# EAGLE design ap3036b-boost-driver-mk-2.0 (EAGLE 7.5.0)
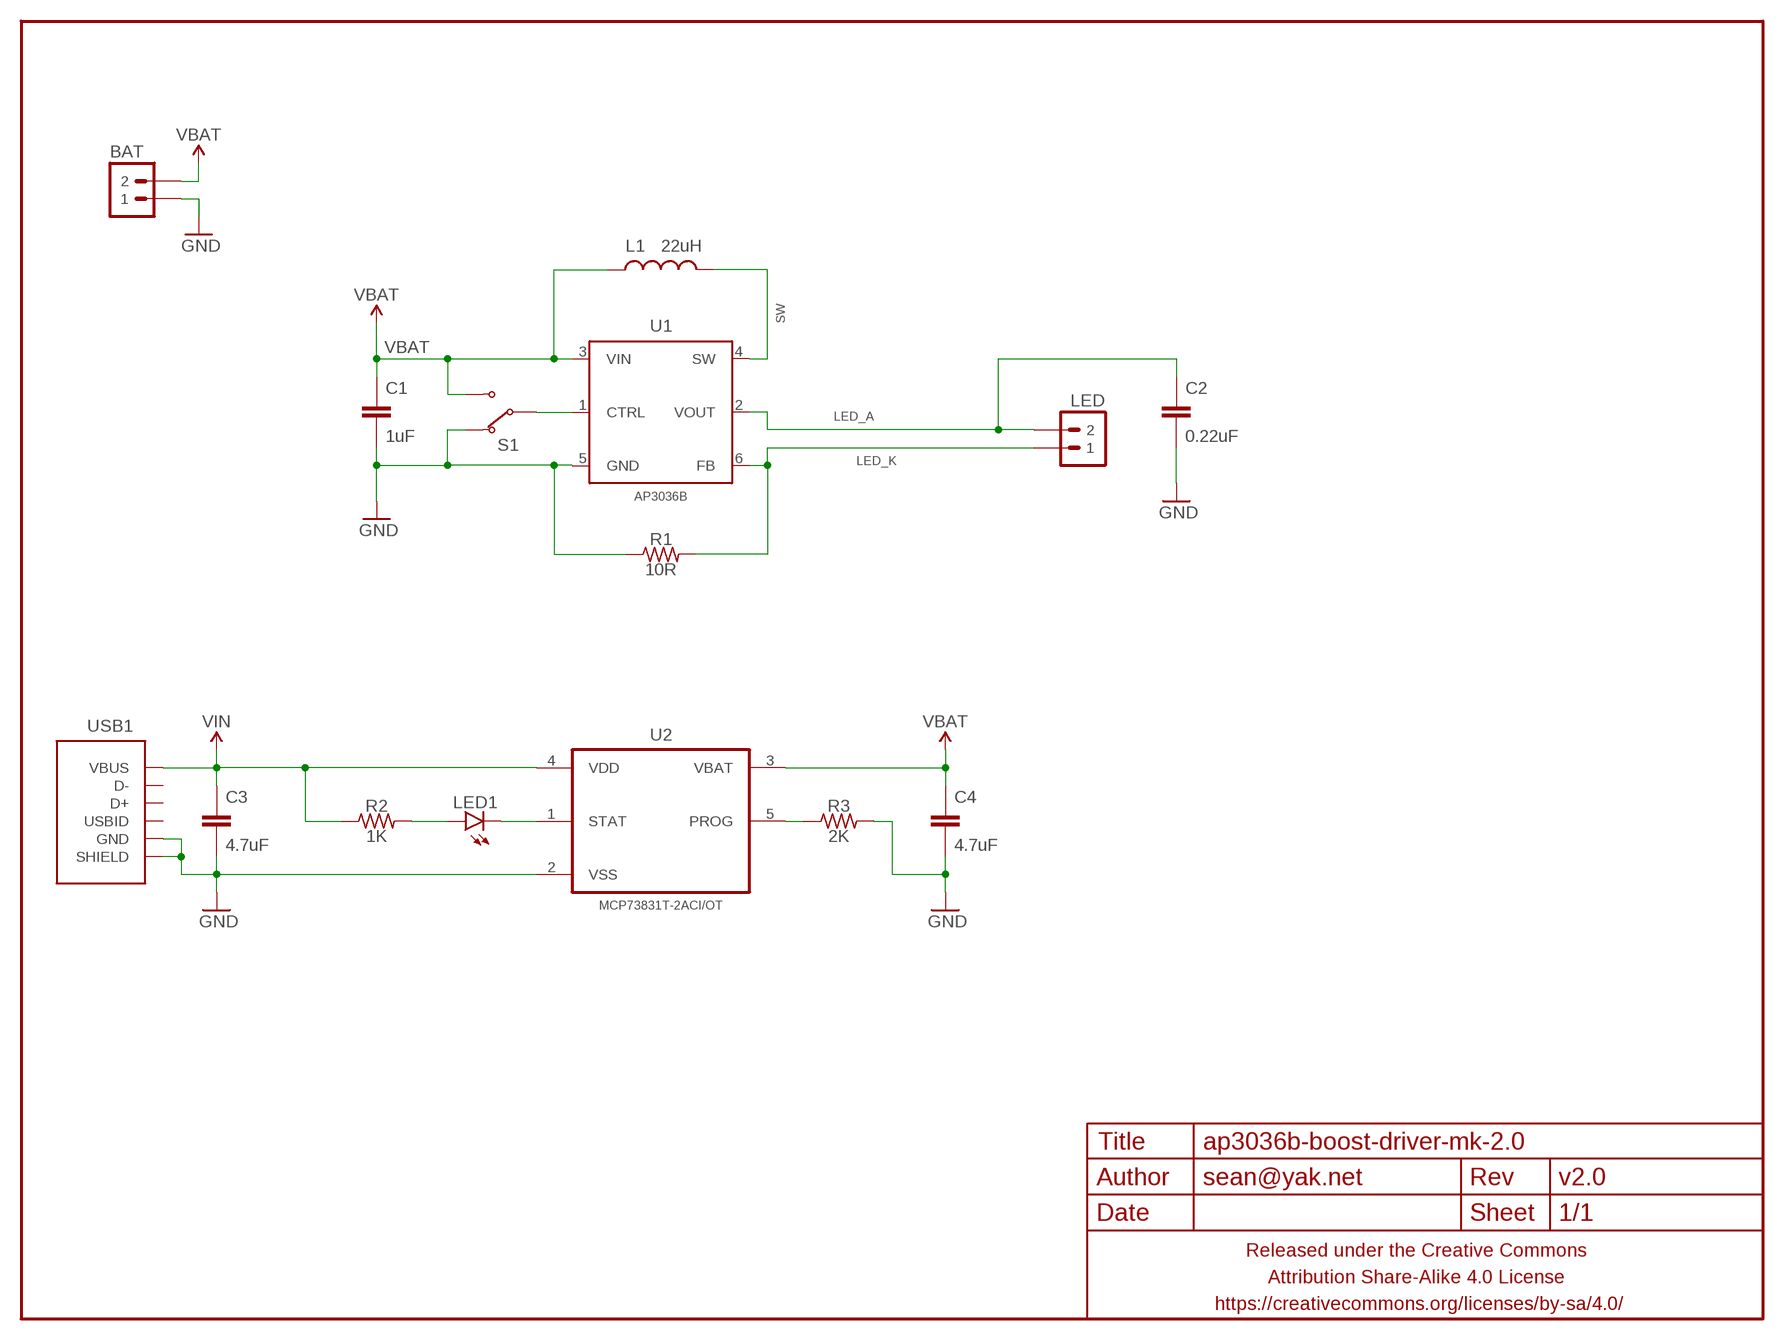
[diagram p0: schematic, sheet 1]

## Parts
BAT  M02PTH-CENTERED  [1X02-CENTER]
C1  1uF  CAPACITOR-CERAMICC0603-TIGHTER  [C0603-TIGHTER]
C2  0.22uF  CAPACITOR-CERAMICC0603-TIGHTER  [C0603-TIGHTER]
C3  4.7uF  CAPACITOR-CERAMICC0603-TIGHTER  [C0603-TIGHTER]
C4  4.7uF  CAPACITOR-CERAMICC0603-TIGHTER  [C0603-TIGHTER]
FRAME1  FRAME-LETTERNO_PACKAGE  [DUMMY]
L1  22uH  INDUCTOR0603-TIGHTER  [L0603]
LED  M02PTH-CENTERED  [1X02-CENTER]
LED1  LED0603-TIGHT  [LED-0603-TIGHT]
R1  10R  RESISTORR0603-TIGHTER  [R0603-TIGHTER]
R2  1K  RESISTORR0603-TIGHTER  [R0603-TIGHTER]
R3  2K  RESISTORR0603-TIGHTER  [R0603-TIGHTER]
S1  SWITCH-SPDTJS102011SAQN  [SWITCH-SPDT-SMD-RA-JS102011SAQN]
U1  AP3036B  [SOT26]
U2  MCP73831T-2ACI/OT  [SOT95P280X145-5N]
USB1  USB-AB-SHIELDFCI-10118193-USB-MICRO-B  [FCI-10118193-USB-MICRO-B]

## Nets
GND: BAT.1 C1.2 C2.2 C3.2 C4.2 R1.1 R3.2 S1.3(NC) U1.5(GND) U2.2(VSS) USB1.5(GND) USB1.SHIELD@1(SHIELD) USB1.SHIELD@2(SHIELD) USB1.SHIELD@3(SHIELD) USB1.SHIELD@4(SHIELD)
LED_A: C2.1 LED.2 U1.2(VOUT)
LED_K: LED.1 R1.2 U1.6(FB)
N$1: LED1.C U2.1(STAT)
N$2: S1.2(COM) U1.1(CTRL)
N$3: LED1.A R2.2
N$4: R3.1 U2.5(PROG)
SW: L1.2 U1.4(SW)
VBAT: BAT.2 C1.1 C4.1 L1.1 S1.1(NO) U1.3(VIN) U2.3(VBAT)
VIN: C3.1 R2.1 U2.4(VDD) USB1.1(VBUS)
Unconnected: USB1.2(D-) USB1.3(D+) USB1.4(USBID)

## Library data of the parts
BAT LED = a_parts:M02: Standard 2-pin 0.1" header. Use with - straight break away headers ( PRT-00116) - right angle break away headers (PRT-00553) - swiss pins (PRT-00743) - machine pins (PRT-00117) - female headers (PRT-00115) Molex polarized connector foot print use with: PRT-08233 with associated crimp pins and housings. 2.54_SCREWTERM for use with PRT-10571. 3.5mm Screw Terminal footprints for PRT-08084 5mm Screw Terminal footprints for use with PRT-08433
C1-C4 = a_parts:CAPACITOR-CERAMIC: CAPACITOR, European symbol
FRAME1 = a_parts:FRAME-LETTER: Schematic Frame Standard 8.5x11 US Letter frame; DESIGNER: sean@yak.net; VERSION: v2.0
L1 = a_parts:INDUCTOR: Inductors Basic Inductor/Choke - 0603 and 1206. Footprints are not proven and vary greatly between part numbers. SRN6045- 33uH, 20% 1.4A SDR0403-560KL - 56uH, 10%, 500mA RMS/740mA peak
LED1 = a_parts:LED: LEDs Standard schematic elements and footprints for 5mm, 3mm, 1206, and 0603 sized LEDs. 5mm - Spark Fun Electronics SKU : COM-00529 (and others)
R1-R3 = a_parts:RESISTOR: RESISTOR, American symbol
S1 = a_parts:SWITCH-SPDT
U1 = a_parts:AP3036B
U2 = a_parts:MCP73831T-2ACI/OT: Charge Management Controller; MPN: MCP73831T-2ACI/OT; OC_FARNELL: 1332158; OC_NEWARK: 56K7045; PACKAGE: SOT-5; SUPPLIER: Microchip
USB1 = a_parts:USB-AB-SHIELD

## Board
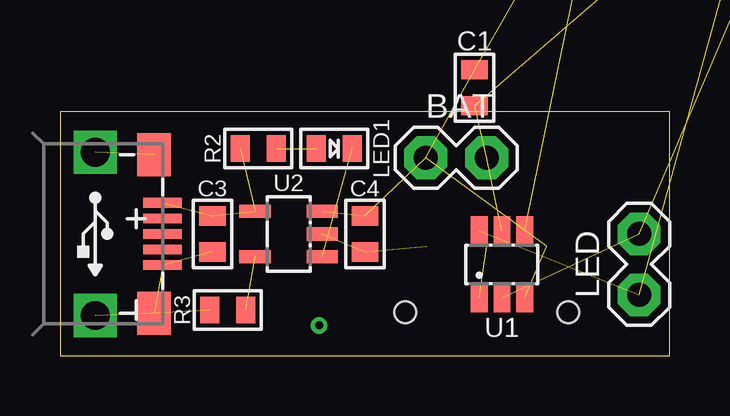
[diagram p1: board, top side]
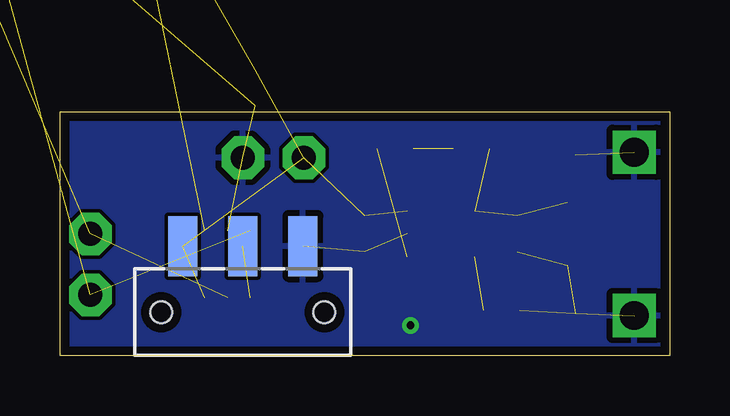
[diagram p2: board, bottom side, seen from below]

Size 25.4 x 10.16 mm. Coordinates in mm from the lower left corner, seen from the top.
Outline: 25.4,0 25.4,10.16 0,10.16 0,0 25.4,0
Copper layers (1*16): Top 0.0356mm / dielectric 1.5011mm / Bottom 0.0356mm
Design rules "LaenPCBOrder2": minimum track width 6mil, minimum drill 13mil, track to track 6mil, track to pad 6mil, pad to pad 6mil, via to via 6mil, smd to smd 6mil, copper to edge 15mil, drill to drill 6mil, minimum pad ring 7mil, minimum via ring 7mil, stop-mask expansion 3mil, vias tented up to drill 20mil, thermal gap 10mil

### Footprints (pad centres in the part's own frame; a part is rotated, then mirrored left to right if it is on the bottom)
1X02-CENTER = drill 1 pad 1.778 octagon: 1 -1.27,0; 2 1.27,0
C0603-TIGHTER = smd 0.8 x 1.1: 1 -0.75,0; 2 0.75,0
L0603 = smd 0.8 x 1.1: 1 -0.75,0; 2 0.75,0
LED-0603-TIGHT = smd 0.8 x 1.1: A 0.75,0; C -0.75,0
R0603-TIGHTER = smd 0.8 x 1.1: 1 -0.75,0; 2 0.75,0
SWITCH-SPDT-SMD-RA-JS102011SAQN = smd 1.2 x 2.5: 1 -2.5,0; 2 0,0; 3 2.5,0 | hole 0.9: -3.4,-2.75; 3.4,-2.75
SOT26 = smd 0.7 x 1.2: 1 -0.95,-1.4; 2 0,-1.4; 3 0.95,-1.4; 4 0.95,1.4; 5 0,1.4; 6 -0.95,1.4
SOT95P280X145-5N = smd 1.3 x 0.55: 1 -1.4,0.95; 2 -1.4,0; 3 -1.4,-0.95; 4 1.4,-0.95; 5 1.4,0.95
FCI-10118193-USB-MICRO-B = smd 0.4 x 1.6: 1 -1.3,2.8; 2 -0.65,2.8; 3 0,2.8; 4 0.65,2.8; 5 1.3,2.8 | smd 1.8 x 1.4: SHIELD@1 -3.3,2.45; SHIELD@2 3.3,2.45 | drill 1.2 pad 1.8 square: SHIELD@3 -3.4,0; SHIELD@4 3.4,0

### Placement (x,y rotation side)
BAT  16.51,8.26 180 top
C1  17.27,11.18 270 top
C2  31.11,20.7 270 top  (outside the outline)
C3  6.35,5.08 270 top
C4  12.7,5.08 270 top
FRAME1  0,0 0 top
L1  22.23,19.81 270 top  (outside the outline)
LED  24.13,3.81 90 top
LED1  11.43,8.64 180 top
R1  28.57,19.43 270 top  (outside the outline)
R2  8.26,8.64 0 top
R3  6.99,1.91 180 top
S1  17.78,4.57 0 bottom
U1  18.41,3.81 0 top
U2  9.53,5.08 180 top
USB1  1.47,5.08 270 top

### Tracks (layer width: path | path; a pad name or v marks a point on that pad's centre or on a via)
GND  (via drill 0.33)  (11 unrouted)
  other vias: 10.79,1.27
  pour Bottom (isolate 0.152, rank 6): 0,10.16 25.4,10.16 25.4,0 0,0
LED_A  (2 unrouted)
LED_K  (2 unrouted)
N$1  (1 unrouted)
N$2  (1 unrouted)
N$3  (1 unrouted)
N$4  (1 unrouted)
SW  (1 unrouted)
VBAT  (6 unrouted)
VIN  (3 unrouted)

### Text on the board
tPlace: A | K
bPlace: LED / Driver | Boost